# Altium schematic sheet followEmSCH.SchDoc
size A4
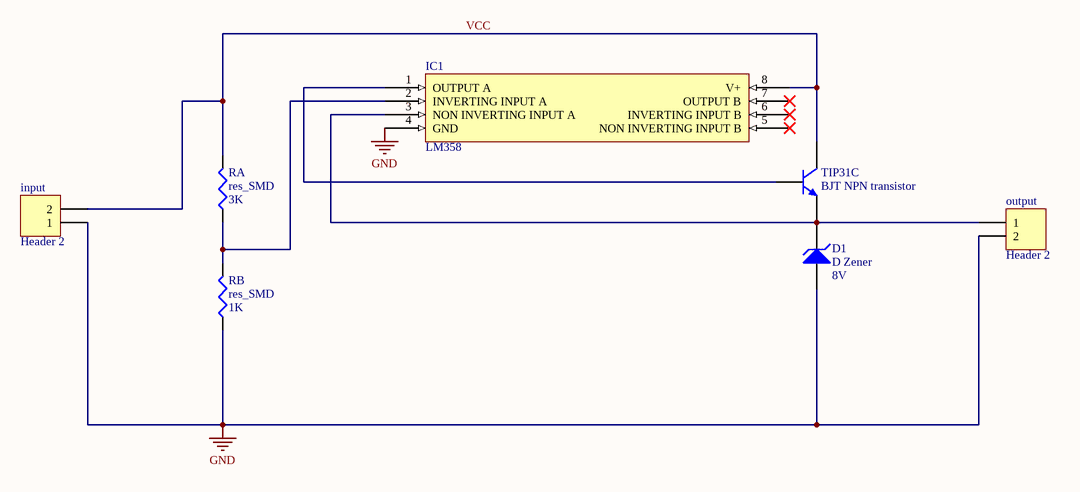
[diagram p0: followEmSCH.SchDoc]

## Parts
D1  D Zener  value 8V  [DO-214AC]
IC1  LM358  [SOIC-8]
input  Header 2  [HDR1X2]
output  Header 2  [HDR1X2]
RA  res_SMD  value 3K  [RES 0805 2012]
RB  res_SMD  value 1K  [RES 0805 2012]
TIP31C  BJT NPN transistor  [TO-220-AB]

## Nets
GND: D1.1(A) IC1.4(GND) input.1 output.2 RB.1
VCC: IC1.8(V+) input.2 RA.2 TIP31C.2(C)
NetD1_2: D1.2(K) IC1.3(NON_INVERTING_INPUT_A) output.1 TIP31C.3(E)
NetIC1_1: IC1.1(OUTPUT_A) TIP31C.1(B)
NetIC1_2: IC1.2(INVERTING_INPUT_A) RA.1 RB.2

Not connected (* = marked no-connect by the designer): IC1 5(NON_INVERTING_INPUT_B)* 6(INVERTING_INPUT_B)* 7(OUTPUT_B)*

## Library data of the parts
D1 = D Zener: Zener Diode
input output = Header 2: Header, 2-Pin; LatestRevisionDate: 17-Jul-2002; LatestRevisionNote: Re-released for DXP Platform.; Publisher: Altium Limited
RA RB = res_SMD: Resistor; Published: 8-Jun-2000; LatestRevisionDate: 29-May-2009; LatestRevisionNote: IPC-7351 Footprint Added.; PackageReference: J1-0603; Publisher: Altium Limited; PackageDescription: Chip Resistor
TIP31C = BJT NPN transistor: NPN General Purpose Amplifier; Published: 8-Jun-2000; LatestRevisionDate: 15-Jan-2003; LatestRevisionNote: PCB Footprint 'BCY-W3/D4.7' replaced; DatasheetVersion: 1997; PackageVersion: Sep-1998; PackageReference: TO-92A; Publisher: Altium Limited; PackageDescription: TO, Flat Index; 3 In-Line, Axial Leads; Body Dia. 4.5mm; Leads 0.51 x 0.48 mm (max); ComponentLink1Description: Manufacturer Link; ComponentLink1URL: http://www.fairchildsemi.com/; ComponentLink2Description: Datasheet; ComponentLink2URL: http://www.fairchildsemi.com/ds/2N%2F2N3904.pdf